# EasyEDA schematic Clap sequence light switch.json
TITLE: Clap sequence sensor schematic; REV: 1.0; Date: 2021-06-01; Sheet: 1/1; Company: Aditya Nair
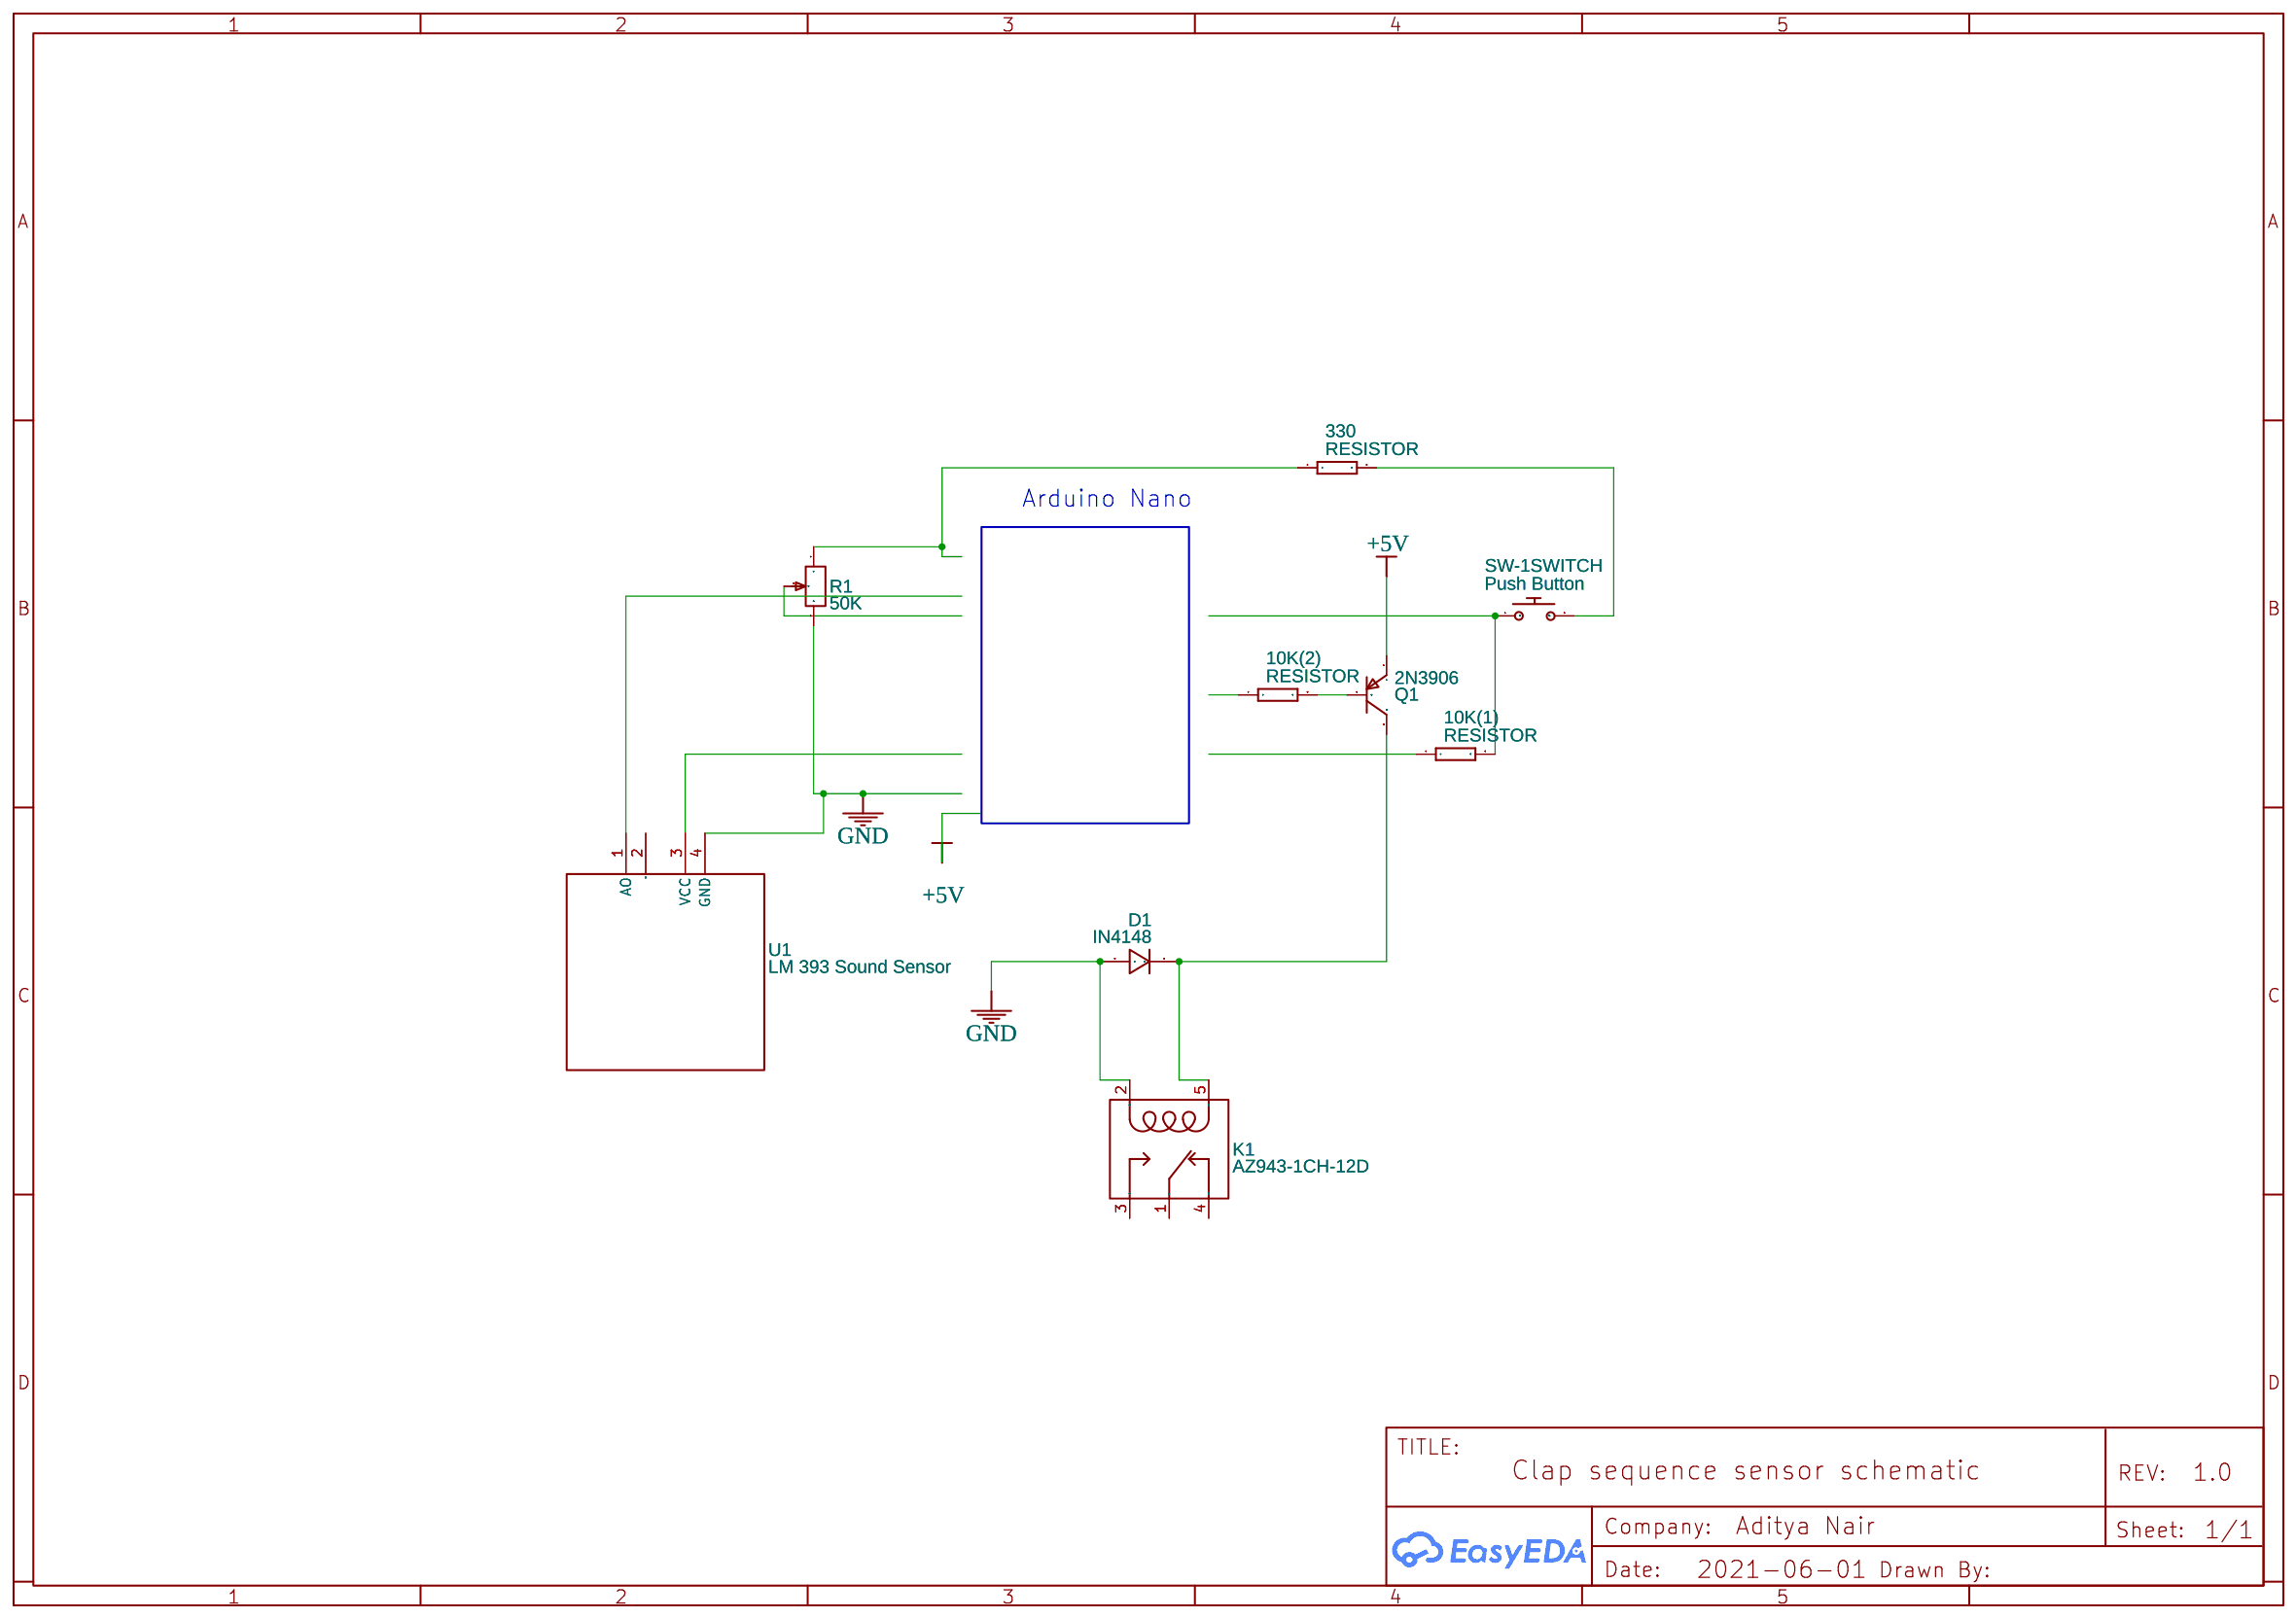
[diagram p0: schematic sheet]

## Parts
10K(1)  RESISTOR  [RTH025W]
10K(2)  RESISTOR  [RTH025W]
330  RESISTOR  [RTH025W]
D1  IN4148  [DO-35_BD2.0-L4.2-P8.20-D0.5-RD]
K1  AZ943-1CH-12D  [RELAY-TH_AZ943-1CH-XXD]
Q1  2N3906  [TO-92-3_L4.9-W3.7-P1.27-L]
R1  50K  [RES-ADJ-TH_RM063]
SW-1SWITCH  Push Button  [SMD-BUTTON]
U1  LM 393 Sound Sensor  [GROVE - SOUND SENSOR]

## Library data of the parts
10K(1) 10K(2) 330 = RESISTOR: Contributor: DangerousPrototype
D1 = IN4148: Supplier: LCSC; Supplier Part: C14538; Manufacturer: Semtech; Contributor: LCSC; JLCPCB Part Class: Extended Part
K1 = AZ943-1CH-12D: Supplier: LCSC; Supplier Part: C480616; Manufacturer: ZETTLER; Contributor: LCSC; JLCPCB Part Class: Extended Part
Q1 = 2N3906: Supplier: LCSC; Manufacturer: CJ; Supplier Part: C9809; JLCPCB Part Class: Extended Part
R1 = RM063-503 50K: Supplier: LCSC; Manufacturer: JML; Supplier Part: C55977
SW-1SWITCH = Push Button: sourceId: M82WewO60; Supplier Part: COM-08720; Supplier: SparkFun
U1 = Grove - Sound Sensor: sourceId: cDBzjhecM; Supplier Part: undefined; Supplier: SeeedStudio

## Nets
+5V: Q1.1(E)
GND: D1.2 K1.2(COIL2) R1.3 U1.4(GND)
Net-(10K(1)-2): 10K(1).2 SW-1SWITCH.1(P$1)
Net-(10K(2)-2): 10K(2).2 Q1.2(B)
Net-(330-1): 330.1 R1.1
Net-(330-2): 330.2 SW-1SWITCH.2(P$2)
Net-(D1-1): D1.1 K1.5(COIL1) Q1.3(C)

Not connected (* = marked no-connect by the designer): 10K(1) 1; 10K(2) 1; K1 1(C) 3(NO) 4(NC); R1 2; U1 1(AO) 2(NC) 3(VCC)

## Notes on the sheet
- Arduino Nano
